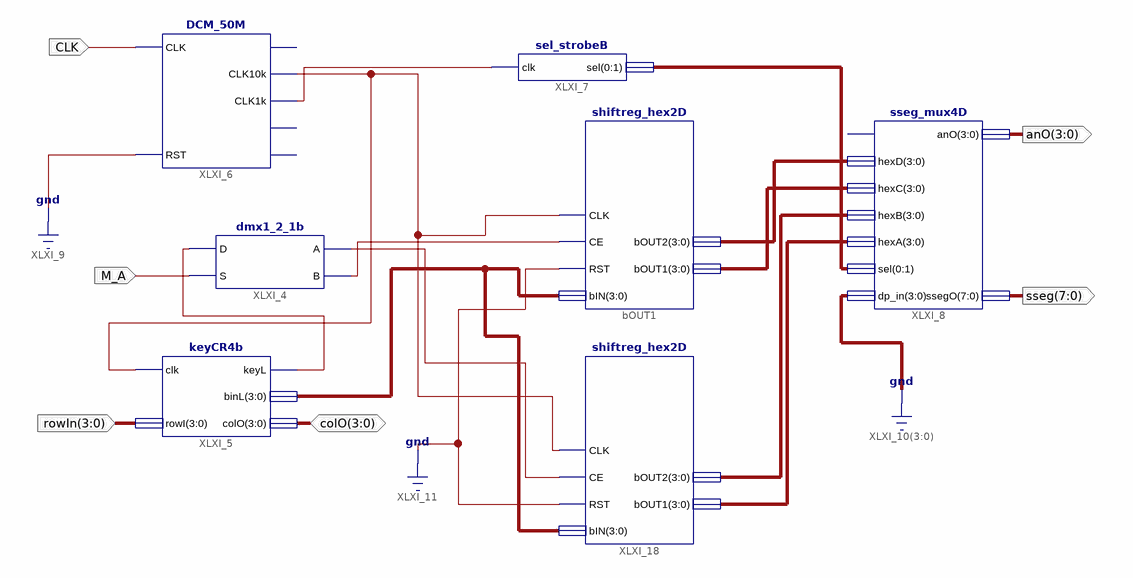
[diagram p0: schematic sheet 1]
// Xilinx ISE schematic l7exp11.sch (spartan3e) as structural Verilog: 7 symbols, 6 ports
module l7exp11 (
  input  M_A,
  input  CLK,
  input  [3:0] rowIn,
  inout  [3:0] colO,
  output [3:0] anO,
  output [7:0] sseg
);

  wire XLXN_2, XLXN_19, XLXN_48, XLXN_53, XLXN_71;
  wire [1:0] XLXN_58;
  wire [3:0] bOUT1, bOUT2, XLXN_4, XLXN_25, XLXN_57;

  dmx1_2_1b XLXI_4 (.D(XLXN_2), .S(M_A), .A(XLXN_53), .B(XLXN_48));
  keyCR4b XLXI_5 (.clk(XLXN_71), .rowI(rowIn), .keyL(XLXN_2), .binL(XLXN_4), .colO(colO));
  DCM_50M XLXI_6 (.CLK(CLK), .RST(1'b0), .CLK10k(XLXN_71), .CLK1k(XLXN_19));  // open: CLK1M, CLK100, CLK1
  sel_strobeB XLXI_7 (.clk(XLXN_19), .sel({XLXN_58[0], XLXN_58[1]}));
  sseg_mux4D XLXI_8 (
    .hexD(bOUT2), .hexC(bOUT1), .hexB(XLXN_25), .hexA(XLXN_57), .sel({XLXN_58[0], XLXN_58[1]}),
    .dp_in(4'b0000), .anO(anO), .ssegO(sseg));  // open: rb_in
  shiftreg_hex2D u_bOUT1 (.CE(XLXN_48), .RST(1'b0), .CLK(XLXN_71), .bIN(XLXN_4), .bOUT1(bOUT1), .bOUT2(bOUT2));
  shiftreg_hex2D XLXI_18 (.CE(XLXN_53), .RST(1'b0), .CLK(XLXN_71), .bIN(XLXN_4), .bOUT1(XLXN_57), .bOUT2(XLXN_25));
endmodule
